# Altium schematic sheet DAC.SchDoc: Phaser
size 420 x 297 mm; EDA_Number: ARTIQ; Projet: ARTIQ/SINARA; Author: G.Kasprowicz; CompanyName: WUT ISE; DrawnBy: G.Kasprowicz; Organization: WUT ISE; Address1: PW ISE; Address2: Nowowiejska 15/19 00-665 Warsaw; Address3: gkasprow@gmail.com; Revision: 2; SheetNumber: -; SheetTotal: -; ModifiedBy: -; CheckedDate: -; Title2: xxx; DivGrp: WUT ISE; Designer: G.Kasprowicz; ModifiedDate: -; ProjectName: Sensor Box
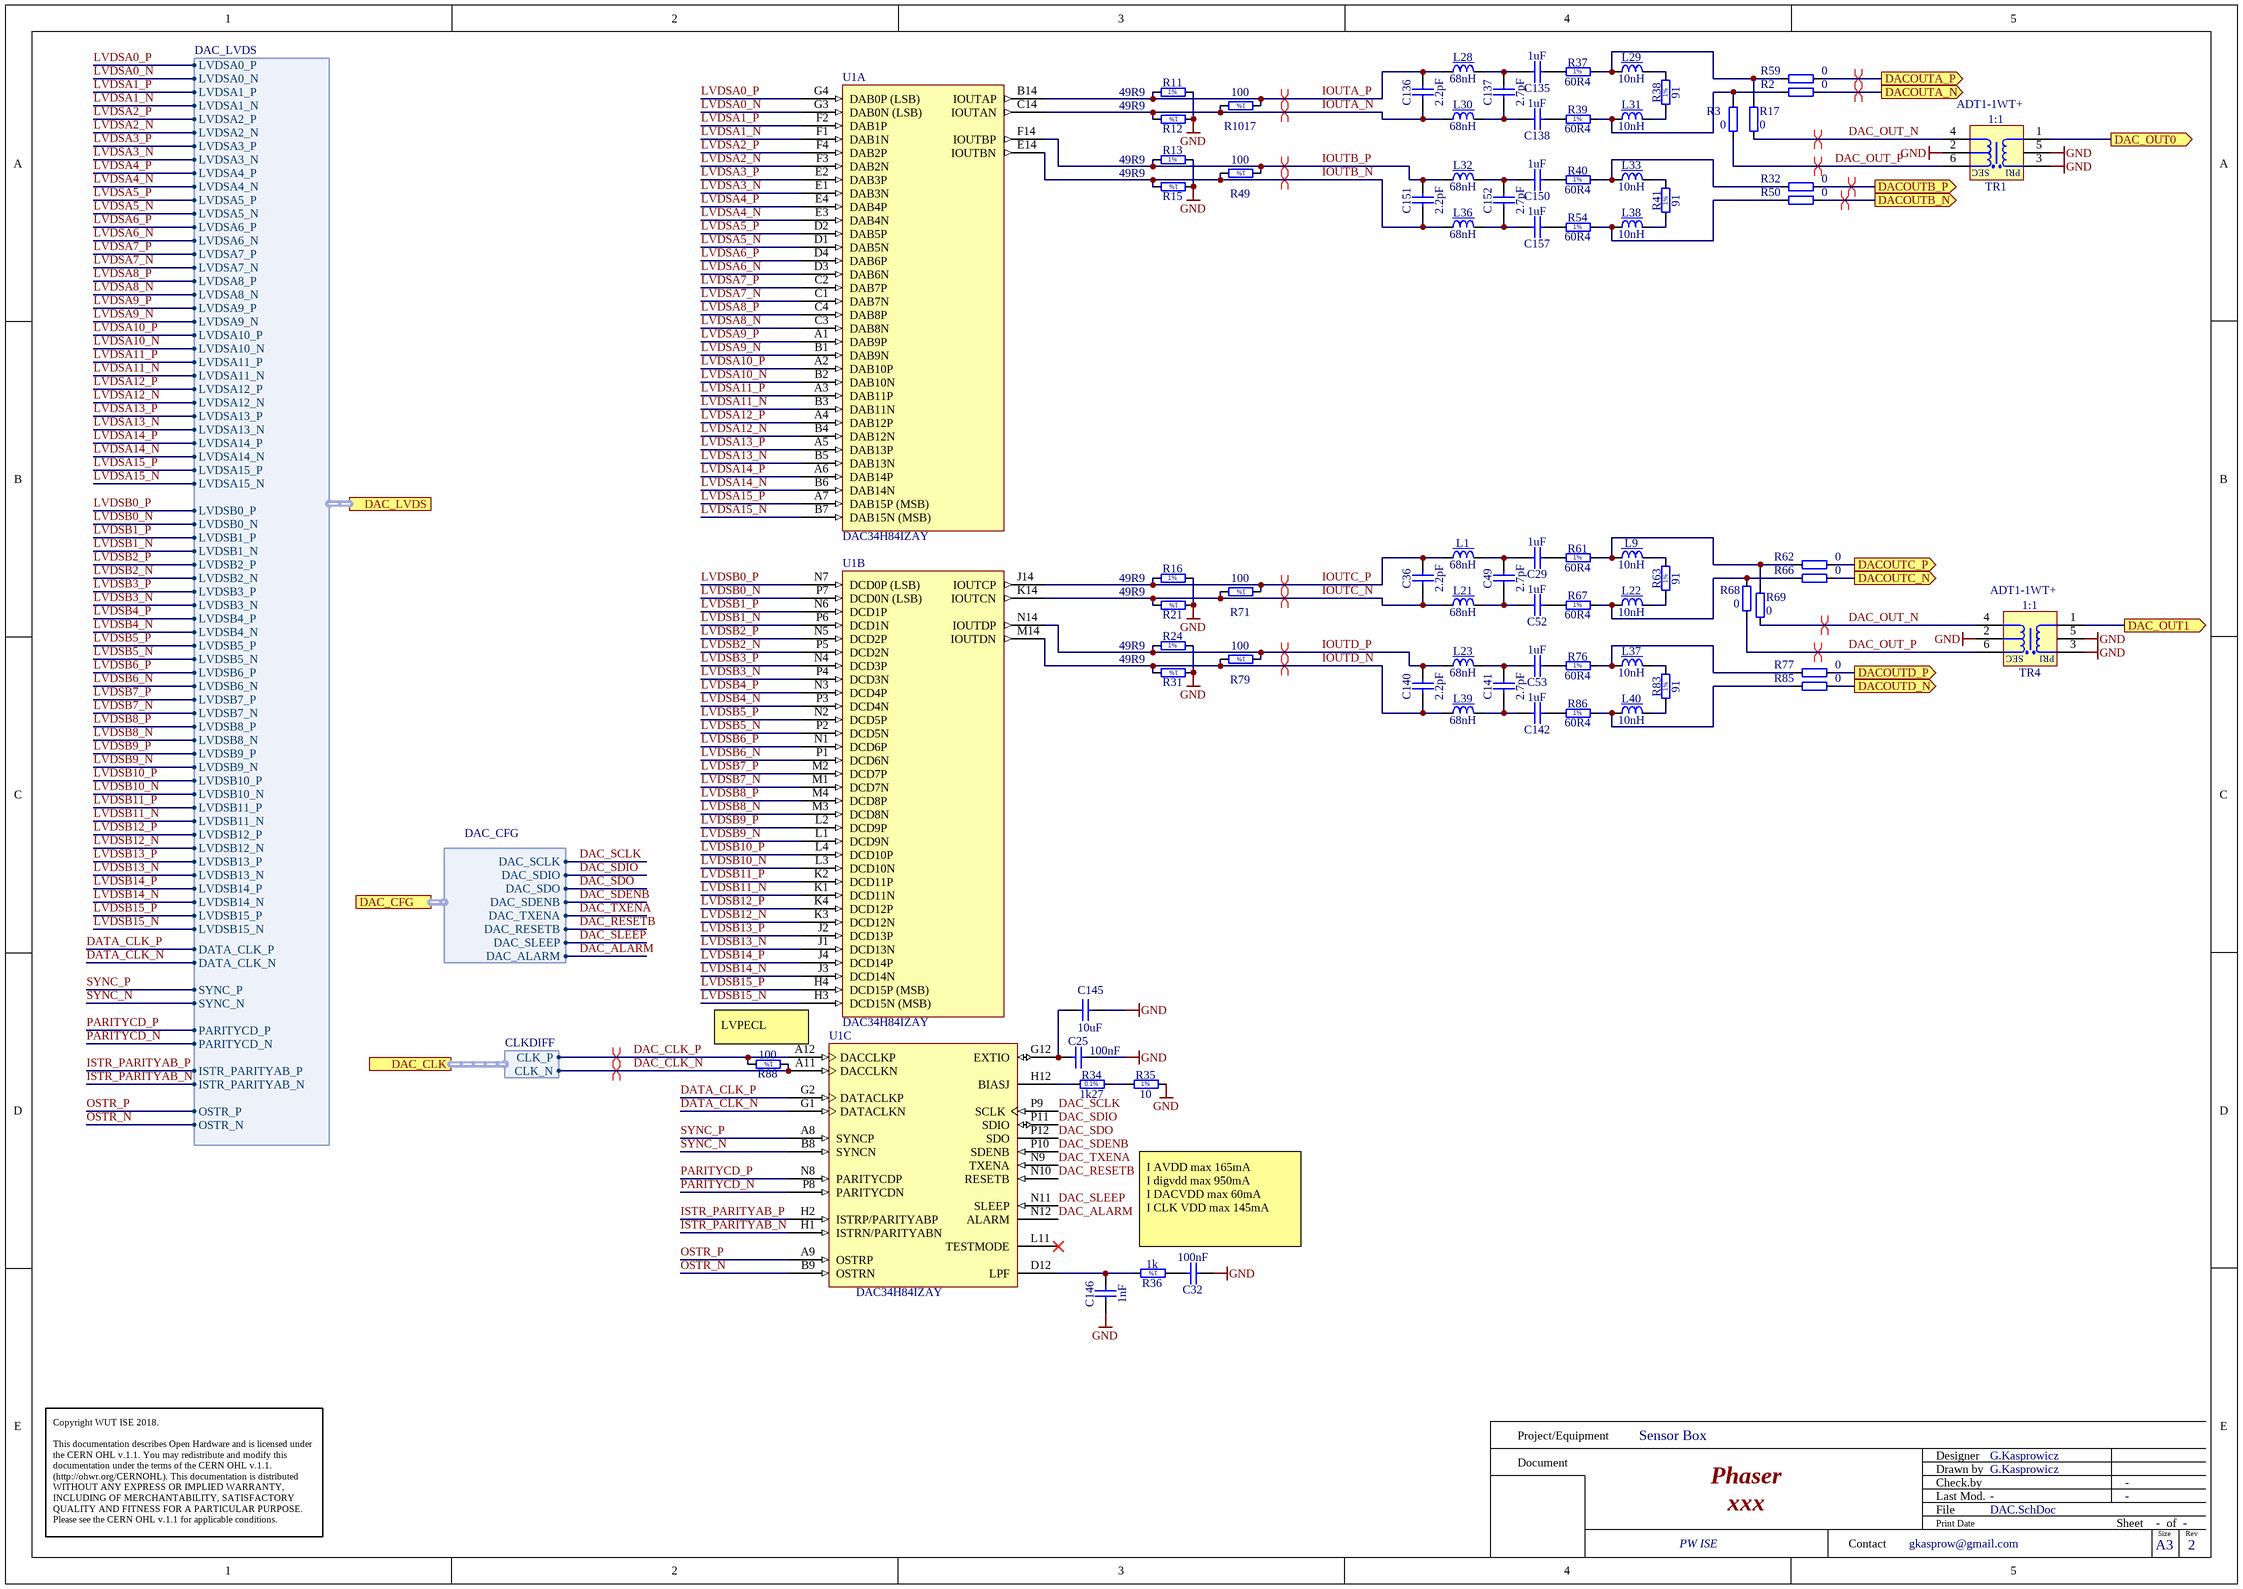
[diagram p0: DAC.SchDoc]

## Parts
C25  100nF  [CAPC1005X55N]
C29  1uF  [CAPC1005X55N]
C32  100nF  [CAPC1608X90N]
C36  2.2pF  [CAPC1608X87N]
C49  2.7pF  [CAPC1608X87N]
C52  1uF  [CAPC1005X55N]
C53  1uF  [CAPC1005X55N]
C135  1uF  [CAPC1005X55N]
C136  2.2pF  [CAPC1608X87N]
C137  2.7pF  [CAPC1608X87N]
C138  1uF  [CAPC1005X55N]
C140  2.2pF  [CAPC1608X87N]
C141  2.7pF  [CAPC1608X87N]
C142  1uF  [CAPC1005X55N]
C145  10uF  [CAPC2012X95N]
C146  1nF  [CAPC1608X90N]
C150  1uF  [CAPC1005X55N]
C151  2.2pF  [CAPC1608X87N]
C152  2.7pF  [CAPC1608X87N]
C157  1uF  [CAPC1005X55N]
L1  68nH  [IND_COILCRAFT_0603HP]
L9  10nH  [IND_COILCRAFT_0402DC]
L21  68nH  [IND_COILCRAFT_0603HP]
L22  10nH  [IND_COILCRAFT_0402DC]
L23  68nH  [IND_COILCRAFT_0603HP]
L28  68nH  [IND_COILCRAFT_0603HP]
L29  10nH  [IND_COILCRAFT_0402DC]
L30  68nH  [IND_COILCRAFT_0603HP]
L31  10nH  [IND_COILCRAFT_0402DC]
L32  68nH  [IND_COILCRAFT_0603HP]
L33  10nH  [IND_COILCRAFT_0402DC]
L36  68nH  [IND_COILCRAFT_0603HP]
L37  10nH  [IND_COILCRAFT_0402DC]
L38  10nH  [IND_COILCRAFT_0402DC]
L39  68nH  [IND_COILCRAFT_0603HP]
L40  10nH  [IND_COILCRAFT_0402DC]
R2  0  [RESC1005X40N]
R3  0  [RESC1005X40N]
R11  49R9  [RESC1005X40N]
R12  49R9  [RESC1005X40N]
R13  49R9  [RESC1005X40N]
R15  49R9  [RESC1005X40N]
R16  49R9  [RESC1005X40N]
R17  0  [RESC1005X40N]
R21  49R9  [RESC1005X40N]
R24  49R9  [RESC1005X40N]
R31  49R9  [RESC1005X40N]
R32  0  [RESC1005X40N]
R34  1k27  [RESC1608X55N]
R35  10  [RESC1005X40N]
R36  1k  [RESC1608X55N]
R37  60R4  [RESC1005X40N]
R38  91  [RESC1005X40N]
R39  60R4  [RESC1005X40N]
R40  60R4  [RESC1005X40N]
R41  91  [RESC1005X40N]
R49  100  [RESC0603X28N]
R50  0  [RESC1005X40N]
R54  60R4  [RESC1005X40N]
R59  0  [RESC1005X40N]
R61  60R4  [RESC1005X40N]
R62  0  [RESC1005X40N]
R63  91  [RESC1005X40N]
R66  0  [RESC1005X40N]
R67  60R4  [RESC1005X40N]
R68  0  [RESC1005X40N]
R69  0  [RESC1005X40N]
R71  100  [RESC0603X28N]
R76  60R4  [RESC1005X40N]
R77  0  [RESC1005X40N]
R79  100  [RESC0603X28N]
R83  91  [RESC1005X40N]
R85  0  [RESC1005X40N]
R86  60R4  [RESC1005X40N]
R88  100  [RESC0603X28N]
R1017  100  [RESC0603X28N]
TR1  1:1  Manufacturer Part Number: ADT1-1WT+  [XFMR_MINI-CIRCUITS_CD542]
TR4  1:1  Manufacturer Part Number: ADT1-1WT+  [XFMR_MINI-CIRCUITS_CD542]
U1  DAC34H84IZAY  [TI-ZAY196]  (parts A,B,C of 5)

## Ports
DAC_CFG (harness DAC_CFG), DAC_CLK (harness CLKDIFF), DAC_LVDS (harness DAC_LVDS), DAC_OUT0 (out), DAC_OUT1 (out), DACOUTA_N (out), DACOUTA_P (out), DACOUTB_N (out), DACOUTB_P (out), DACOUTC_N (out), DACOUTC_P (out), DACOUTD_N (out), DACOUTD_P (out)

## Harnesses
DAC_CFG: DAC_SCLK, DAC_SDIO, DAC_SDO, DAC_SDENB, DAC_TXENA, DAC_RESETB, DAC_SLEEP, DAC_ALARM
DAC_LVDS: LVDSA0_P, LVDSA0_N, LVDSA1_P, LVDSA1_N, LVDSA2_P, LVDSA2_N, LVDSA3_P, LVDSA3_N, LVDSA4_P, LVDSA4_N, LVDSA5_P, LVDSA5_N, LVDSA6_P, LVDSA6_N, LVDSA7_P, LVDSA7_N, LVDSA8_P, LVDSA8_N, LVDSA9_P, LVDSA9_N, LVDSA10_P, LVDSA10_N, LVDSA11_P, LVDSA11_N, LVDSA12_P, LVDSA12_N, LVDSA13_P, LVDSA13_N, LVDSA14_P, LVDSA14_N, LVDSA15_P, LVDSA15_N, LVDSB0_P, LVDSB0_N, LVDSB1_P, LVDSB1_N, LVDSB2_P, LVDSB2_N, LVDSB3_P, LVDSB3_N, LVDSB4_P, LVDSB4_N, LVDSB5_P, LVDSB5_N, LVDSB6_P, LVDSB6_N, LVDSB7_P, LVDSB7_N, LVDSB8_P, LVDSB8_N, LVDSB9_P, LVDSB9_N, LVDSB10_P, LVDSB10_N, LVDSB11_P, LVDSB11_N, LVDSB12_P, LVDSB12_N, LVDSB13_P, LVDSB13_N, LVDSB14_P, LVDSB14_N, LVDSB15_P, LVDSB15_N, DATA_CLK_P, DATA_CLK_N, SYNC_P, SYNC_N, PARITYCD_P, PARITYCD_N, ISTR_PARITYAB_P, ISTR_PARITYAB_N, OSTR_P, OSTR_N
CLKDIFF: CLK_N, CLK_P

## Nets
GND: C25.2 C32.1 C145.1 C146.1 R11.2 R12.1 R13.2 R15.1 R16.2 R21.1 R24.2 R31.1 R35.2 TR1.2(SCT) TR1.3(PDOT) TR1.5(NC) TR4.2(SCT) TR4.3(PDOT) TR4.5(NC)
DAC_ALARM: U1.N12(ALARM) ; port DAC_CFG.DAC_ALARM
DAC_CLK_N: R88.1 U1.A11(DACCLKN) ; port DAC_CLK.CLK_N
DAC_CLK_P: R88.2 U1.A12(DACCLKP) ; port DAC_CLK.CLK_P
DAC_OUT0: TR1.1(P) ; port DAC_OUT0
DAC_OUT1: TR4.1(P) ; port DAC_OUT1
DAC_OUT_N: R17.1 R69.1 TR1.4(S) TR4.4(S)
DAC_OUT_P: R3.1 R68.1 TR1.6(SDOT) TR4.6(SDOT)
DAC_RESETB: U1.N10(RESETB) ; port DAC_CFG.DAC_RESETB
DAC_SCLK: U1.P9(SCLK) ; port DAC_CFG.DAC_SCLK
DAC_SDENB: U1.P10(SDENB) ; port DAC_CFG.DAC_SDENB
DAC_SDIO: U1.P11(SDIO) ; port DAC_CFG.DAC_SDIO
DAC_SDO: U1.P12(SDO) ; port DAC_CFG.DAC_SDO
DAC_SLEEP: U1.N11(SLEEP) ; port DAC_CFG.DAC_SLEEP
DAC_TXENA: U1.N9(TXENA) ; port DAC_CFG.DAC_TXENA
DACOUTA_N: R2.1 ; port DACOUTA_N
DACOUTA_P: R59.1 ; port DACOUTA_P
DACOUTB_N: R50.1 ; port DACOUTB_N
DACOUTB_P: R32.1 ; port DACOUTB_P
DACOUTC_N: R66.1 ; port DACOUTC_N
DACOUTC_P: R62.1 ; port DACOUTC_P
DACOUTD_N: R85.1 ; port DACOUTD_N
DACOUTD_P: R77.1 ; port DACOUTD_P
DATA_CLK_N: U1.G1(DATACLKN) ; port DAC_LVDS.DATA_CLK_N
DATA_CLK_P: U1.G2(DATACLKP) ; port DAC_LVDS.DATA_CLK_P
IOUTA_N: C136.1 L30.1 R12.2 R1017.2 U1.C14(IOUTAN)
IOUTA_P: C136.2 L28.1 R11.1 R1017.1 U1.B14(IOUTAP)
IOUTB_N: C151.1 L36.1 R15.2 R49.2 U1.E14(IOUTBN)
IOUTB_P: C151.2 L32.1 R13.1 R49.1 U1.F14(IOUTBP)
IOUTC_N: C36.1 L21.1 R21.2 R71.2 U1.K14(IOUTCN)
IOUTC_P: C36.2 L1.1 R16.1 R71.1 U1.J14(IOUTCP)
IOUTD_N: C140.1 L39.1 R31.2 R79.2 U1.M14(IOUTDN)
IOUTD_P: C140.2 L23.1 R24.1 R79.1 U1.N14(IOUTDP)
ISTR_PARITYAB_N: U1.H1(ISTRN/PARITYABN) ; port DAC_LVDS.ISTR_PARITYAB_N
ISTR_PARITYAB_P: U1.H2(ISTRP/PARITYABP) ; port DAC_LVDS.ISTR_PARITYAB_P
LVDSA0_N: U1.G3(DAB0N_(LSB)) ; port DAC_LVDS.LVDSA0_N
LVDSA0_P: U1.G4(DAB0P_(LSB)) ; port DAC_LVDS.LVDSA0_P
LVDSA1_N: U1.F1(DAB1N) ; port DAC_LVDS.LVDSA1_N
LVDSA1_P: U1.F2(DAB1P) ; port DAC_LVDS.LVDSA1_P
LVDSA2_N: U1.F3(DAB2N) ; port DAC_LVDS.LVDSA2_N
LVDSA2_P: U1.F4(DAB2P) ; port DAC_LVDS.LVDSA2_P
LVDSA3_N: U1.E1(DAB3N) ; port DAC_LVDS.LVDSA3_N
LVDSA3_P: U1.E2(DAB3P) ; port DAC_LVDS.LVDSA3_P
LVDSA4_N: U1.E3(DAB4N) ; port DAC_LVDS.LVDSA4_N
LVDSA4_P: U1.E4(DAB4P) ; port DAC_LVDS.LVDSA4_P
LVDSA5_N: U1.D1(DAB5N) ; port DAC_LVDS.LVDSA5_N
LVDSA5_P: U1.D2(DAB5P) ; port DAC_LVDS.LVDSA5_P
LVDSA6_N: U1.D3(DAB6N) ; port DAC_LVDS.LVDSA6_N
LVDSA6_P: U1.D4(DAB6P) ; port DAC_LVDS.LVDSA6_P
LVDSA7_N: U1.C1(DAB7N) ; port DAC_LVDS.LVDSA7_N
LVDSA7_P: U1.C2(DAB7P) ; port DAC_LVDS.LVDSA7_P
LVDSA8_N: U1.C3(DAB8N) ; port DAC_LVDS.LVDSA8_N
LVDSA8_P: U1.C4(DAB8P) ; port DAC_LVDS.LVDSA8_P
LVDSA9_N: U1.B1(DAB9N) ; port DAC_LVDS.LVDSA9_N
LVDSA9_P: U1.A1(DAB9P) ; port DAC_LVDS.LVDSA9_P
LVDSA10_N: U1.B2(DAB10N) ; port DAC_LVDS.LVDSA10_N
LVDSA10_P: U1.A2(DAB10P) ; port DAC_LVDS.LVDSA10_P
LVDSA11_N: U1.B3(DAB11N) ; port DAC_LVDS.LVDSA11_N
LVDSA11_P: U1.A3(DAB11P) ; port DAC_LVDS.LVDSA11_P
LVDSA12_N: U1.B4(DAB12N) ; port DAC_LVDS.LVDSA12_N
LVDSA12_P: U1.A4(DAB12P) ; port DAC_LVDS.LVDSA12_P
LVDSA13_N: U1.B5(DAB13N) ; port DAC_LVDS.LVDSA13_N
LVDSA13_P: U1.A5(DAB13P) ; port DAC_LVDS.LVDSA13_P
LVDSA14_N: U1.B6(DAB14N) ; port DAC_LVDS.LVDSA14_N
LVDSA14_P: U1.A6(DAB14P) ; port DAC_LVDS.LVDSA14_P
LVDSA15_N: U1.B7(DAB15N_(MSB)) ; port DAC_LVDS.LVDSA15_N
LVDSA15_P: U1.A7(DAB15P_(MSB)) ; port DAC_LVDS.LVDSA15_P
LVDSB0_N: U1.P7(DCD0N_(LSB)) ; port DAC_LVDS.LVDSB0_N
LVDSB0_P: U1.N7(DCD0P_(LSB)) ; port DAC_LVDS.LVDSB0_P
LVDSB1_N: U1.P6(DCD1N) ; port DAC_LVDS.LVDSB1_N
LVDSB1_P: U1.N6(DCD1P) ; port DAC_LVDS.LVDSB1_P
LVDSB2_N: U1.P5(DCD2N) ; port DAC_LVDS.LVDSB2_N
LVDSB2_P: U1.N5(DCD2P) ; port DAC_LVDS.LVDSB2_P
LVDSB3_N: U1.P4(DCD3N) ; port DAC_LVDS.LVDSB3_N
LVDSB3_P: U1.N4(DCD3P) ; port DAC_LVDS.LVDSB3_P
LVDSB4_N: U1.P3(DCD4N) ; port DAC_LVDS.LVDSB4_N
LVDSB4_P: U1.N3(DCD4P) ; port DAC_LVDS.LVDSB4_P
LVDSB5_N: U1.P2(DCD5N) ; port DAC_LVDS.LVDSB5_N
LVDSB5_P: U1.N2(DCD5P) ; port DAC_LVDS.LVDSB5_P
LVDSB6_N: U1.P1(DCD6N) ; port DAC_LVDS.LVDSB6_N
LVDSB6_P: U1.N1(DCD6P) ; port DAC_LVDS.LVDSB6_P
LVDSB7_N: U1.M1(DCD7N) ; port DAC_LVDS.LVDSB7_N
LVDSB7_P: U1.M2(DCD7P) ; port DAC_LVDS.LVDSB7_P
LVDSB8_N: U1.M3(DCD8N) ; port DAC_LVDS.LVDSB8_N
LVDSB8_P: U1.M4(DCD8P) ; port DAC_LVDS.LVDSB8_P
LVDSB9_N: U1.L1(DCD9N) ; port DAC_LVDS.LVDSB9_N
LVDSB9_P: U1.L2(DCD9P) ; port DAC_LVDS.LVDSB9_P
LVDSB10_N: U1.L3(DCD10N) ; port DAC_LVDS.LVDSB10_N
LVDSB10_P: U1.L4(DCD10P) ; port DAC_LVDS.LVDSB10_P
LVDSB11_N: U1.K1(DCD11N) ; port DAC_LVDS.LVDSB11_N
LVDSB11_P: U1.K2(DCD11P) ; port DAC_LVDS.LVDSB11_P
LVDSB12_N: U1.K3(DCD12N) ; port DAC_LVDS.LVDSB12_N
LVDSB12_P: U1.K4(DCD12P) ; port DAC_LVDS.LVDSB12_P
LVDSB13_N: U1.J1(DCD13N) ; port DAC_LVDS.LVDSB13_N
LVDSB13_P: U1.J2(DCD13P) ; port DAC_LVDS.LVDSB13_P
LVDSB14_N: U1.J3(DCD14N) ; port DAC_LVDS.LVDSB14_N
LVDSB14_P: U1.J4(DCD14P) ; port DAC_LVDS.LVDSB14_P
LVDSB15_N: U1.H3(DCD15N_(MSB)) ; port DAC_LVDS.LVDSB15_N
LVDSB15_P: U1.H4(DCD15P_(MSB)) ; port DAC_LVDS.LVDSB15_P
OSTR_N: U1.B9(OSTRN) ; port DAC_LVDS.OSTR_N
OSTR_P: U1.A9(OSTRP) ; port DAC_LVDS.OSTR_P
PARITYCD_N: U1.P8(PARITYCDN) ; port DAC_LVDS.PARITYCD_N
PARITYCD_P: U1.N8(PARITYCDP) ; port DAC_LVDS.PARITYCD_P
SYNC_N: U1.B8(SYNCN) ; port DAC_LVDS.SYNC_N
SYNC_P: U1.A8(SYNCP) ; port DAC_LVDS.SYNC_P
NetC25_1: C25.1 C145.2 U1.G12(EXTIO)
NetC29_1: C29.1 R61.1
NetC29_2: C29.2 C49.2 L1.2
NetC32_2: C32.2 R36.1
NetC49_1: C49.1 C52.2 L21.2
NetC52_1: C52.1 R67.1
NetC53_1: C53.1 R76.1
NetC53_2: C53.2 C141.2 L23.2
NetC135_1: C135.1 R37.1
NetC135_2: C135.2 C137.2 L28.2
NetC137_1: C137.1 C138.2 L30.2
NetC138_1: C138.1 R39.1
NetC141_1: C141.1 C142.2 L39.2
NetC142_1: C142.1 R86.1
NetC146_2: C146.2 R36.2 U1.D12(LPF)
NetC150_1: C150.1 R40.1
NetC150_2: C150.2 C152.2 L32.2
NetC152_1: C152.1 C157.2 L36.2
NetC157_1: C157.1 R54.1
NetL9_1: L9.1 R61.2 R62.2 R69.2
NetL9_2: L9.2 R63.2
NetL22_1: L22.1 R66.2 R67.2 R68.2
NetL22_2: L22.2 R63.1
NetL29_1: L29.1 R17.2 R37.2 R59.2
NetL29_2: L29.2 R38.2
NetL31_1: L31.1 R2.2 R3.2 R39.2
NetL31_2: L31.2 R38.1
NetL33_1: L33.1 R32.2 R40.2
NetL33_2: L33.2 R41.2
NetL37_1: L37.1 R76.2 R77.2
NetL37_2: L37.2 R83.2
NetL38_1: L38.1 R50.2 R54.2
NetL38_2: L38.2 R41.1
NetL40_1: L40.1 R85.2 R86.2
NetL40_2: L40.2 R83.1
NetR34_1: R34.1 U1.H12(BIASJ)
NetR34_2: R34.2 R35.1

Not connected (* = marked no-connect by the designer): U1 L11(TESTMODE)*

## Layout directives
differential pair; differential pair class I_analog: IOUTA_N, IOUTA_P, IOUTB_N, IOUTB_P, IOUTC_N, IOUTC_P, IOUTD_N, IOUTD_P
differential pair; differential pair class Diff_100Ohm: DAC_CLK_N, DAC_CLK_P
differential pair: DAC_OUT_N, DAC_OUT_P, DACOUTA_N, DACOUTA_P, DACOUTB_N, DACOUTB_P

## Notes on the sheet
- LVPECL
- I AVDD max 165mA
  I digvdd max 950mA
  I DACVDD max 60mA
  I CLK VDD max 145mA
- Project/Equipment
- Document
- Designer
- Drawn by
- Check.by
- Copyright WUT ISE 2018.
  This documentation describes Open Hardware and is licensed under the CERN OHL v.1.1. You may redistribute and modify this documentation under the terms of the CERN OHL v.1.1. (http://ohwr.org/CERNOHL). This documentation is distributed WITHOUT ANY EXPRESS OR IMPLIED WARRANTY, INCLUDING OF MERCHANTABILITY, SATISFACTORY QUALITY AND FITNESS FOR A PARTICULAR PURPOSE. Please see the CERN OHL v.1.1 for applicable conditions.
- Contact
- File
- Last Mod.
- Print Date
- Sheet
- Size
- A3
- of
- Rev
- (in symbol R0201_100R_1%_0.05W_200PPM) 1%
- (in symbol R0402_10R_1%_0.0625W_200PPM) 1%
- (in symbol R0402_49R9_1%_0.0625W_100PPM) 1%
- (in symbol R0402_60R4_1%_0.0625W_100PPM) 1%
- (in symbol R0402_91R_1%_0.0625W_100PPM) 1%
- (in symbol R0603_1K27_0.1%_0.063W_10PPM) 0.1%
- (in symbol R0603_1K_1%_0.1W_100PPM) 1%
- (in symbol XFMR_MINI-CIRCUITS_ADT1-1WT+) SEC; PRI

## Library data of the parts
C25 = CC0402_100NF_16V_10%_X5R: Non-polarised capacitor; Part Description: SMD Multilayer Chip Ceramic Capacitor; Manufacturer: GENERIC; Manufacturer1 Part Number: GRM155R61C104KA88D; Voltage: 16V; TC: X5R; Tolerance: ±10%; Part Number: CC0402_100NF_16V_10%_X5R; Component Kind: Standard; Component Type: Standard; Pin Count: 2; Value: 100nF; Status: None; Manufacturer Part Number: CC0402_100NF_16V_10%_X5R; Case: 0402; Mounted: Yes; Socket: No; SMD: Yes; Sense: No; Manufacturer1 Example: MURATA; Manufacturer1 ComponentHeight: 0.55mm; HelpURL: \\cern.ch\dfs\Applications\Altium\Datasheets\CC0402_X5R_MURATA_GRM.pdf; Author: CERN DEM JLC; CreateDate: 10.12.2013; LatestRevisionDate: 10.12.2013
C29 C52 C53 C135 C138 C142 C150 C157 = CC0402_1UF_16V_10%_X5R: Non-polarised capacitor; Part Description: SMD Multilayer Chip Ceramic Capacitor; Manufacturer: GENERIC; Manufacturer1 Part Number: C1005X5R1C105KT; Voltage: 16V; TC: X5R; Tolerance: ±10%; Part Number: CC0402_1UF_16V_10%_X5R; Component Kind: Standard; Component Type: Standard; Pin Count: 2; Value: 1uF; Status: Preferred; Manufacturer Part Number: CC0402_1UF_16V_10%_X5R; Case: 0402; Mounted: Yes; Socket: No; SMD: Yes; Sense: No; Manufacturer1 Example: TDK; Manufacturer1 ComponentHeight: 0.55mm; HelpURL: \\cern.ch\dfs\Applications\Altium\Datasheets\CC0402_X5R_TDK_C.pdf; Author: CERN DEM JLC; CreateDate: 25.10.2012; LatestRevisionDate: 25.10.2012
C32 = CC0603_100NF_100V_10%_X7R: Non-polarised capacitor; Part Description: SMD Multilayer Chip Ceramic Capacitor; Manufacturer: GENERIC; Manufacturer1 Part Number: GRM188R72A104KA35D; Voltage: 100V; TC: X7R; Tolerance: ±10%; Part Number: CC0603_100NF_100V_10%_X7R; Component Kind: Standard; Component Type: Standard; Pin Count: 2; Value: 100nF; Status: None; Manufacturer Part Number: CC0603_100NF_100V_10%_X7R; Case: 0603; Mounted: Yes; Socket: No; SMD: Yes; Sense: No; Manufacturer1 Example: MURATA; Manufacturer1 ComponentHeight: 0.9mm; HelpURL: \\cern.ch\dfs\Applications\Altium\Datasheets\CC0603_MURATA_GRM188R72A104KA35D.pdf; Author: CERN DEM JLC; CreateDate: 11.12.2013; LatestRevisionDate: 11.12.2013
C36 C136 C140 C151 = CC0603_2.2PF_50V_0.25PF_NP0: Non-polarised capacitor; Part Description: SMD Multilayer Chip Ceramic Capacitor; Manufacturer: GENERIC; Manufacturer1 Part Number: 223886715228; Voltage: 50V; TC: C0G/NP0; Tolerance: ±0.25pF; Part Number: CC0603_2.2PF_50V_0.25PF_NP0; Component Kind: Standard; Component Type: Standard; Pin Count: 2; Value: 2.2pF; Status: Preferred; Manufacturer Part Number: CC0603_2.2PF_50V_0.25PF_NP0; Case: 0603; Mounted: Yes; Socket: No; SMD: Yes; Sense: No; Manufacturer1 Example: PHYCOMP; Manufacturer1 ComponentHeight: 0.87mm; HelpURL: \\cern.ch\dfs\Applications\Altium\Datasheets\CC0603_NP0_PHYCOMP.pdf; Author: CERN DEM JLC; CreateDate: 03.12.2007; LatestRevisionDate: 03.12.2007
C49 C137 C141 C152 = CC0603_2.7PF_50V_0.25PF_NP0: Non-polarised capacitor; Part Description: SMD Multilayer Chip Ceramic Capacitor; Manufacturer: GENERIC; Manufacturer1 Part Number: 223886715278; Voltage: 50V; TC: C0G/NP0; Tolerance: ±0.25pF; Part Number: CC0603_2.7PF_50V_0.25PF_NP0; Component Kind: Standard; Component Type: Standard; Pin Count: 2; Value: 2.7pF; Status: Preferred; Manufacturer Part Number: CC0603_2.7PF_50V_0.25PF_NP0; Case: 0603; Mounted: Yes; Socket: No; SMD: Yes; Sense: No; Manufacturer1 Example: PHYCOMP; Manufacturer1 ComponentHeight: 0.87mm; HelpURL: \\cern.ch\dfs\Applications\Altium\Datasheets\CC0603_NP0_PHYCOMP.pdf; Author: CERN DEM JLC; CreateDate: 03.12.2007; LatestRevisionDate: 03.12.2007
C145 = CC0805_10UF_25V_10%_X5R: Non-polarised capacitor; Part Description: SMD Multilayer Chip Ceramic Capacitor; Manufacturer: GENERIC; Manufacturer1 Part Number: GRM219R61E106KA12D; Voltage: 25V; TC: X5R; Tolerance: ±10%; Part Number: CC0805_10UF_25V_10%_X5R; Component Kind: Standard; Component Type: Standard; Pin Count: 2; Value: 10uF; Status: Preferred; Manufacturer Part Number: CC0805_10UF_25V_10%_X5R; Case: 0805; Mounted: Yes; Socket: No; SMD: Yes; Sense: No; Manufacturer1 Example: MURATA; Manufacturer1 ComponentHeight: 0.95mm; HelpURL: \\cern.ch\dfs\Applications\Altium\Datasheets\CC0805_X5R_MURATA_GRM.pdf; Author: CERN DEM JLC; CreateDate: 25.10.2012; LatestRevisionDate: 06.09.2016
C146 = CC0603_1NF_50V_1%_NP0: Non-polarised capacitor; Part Description: SMD Multilayer Chip Ceramic Capacitor; Manufacturer: GENERIC; Manufacturer1 Part Number: 06035A102FAT2A; Voltage: 50V; TC: C0G/NP0; Tolerance: ±1%; Part Number: CC0603_1NF_50V_1%_NP0; Component Kind: Standard; Component Type: Standard; Pin Count: 2; Value: 1nF; Status: None; Manufacturer Part Number: CC0603_1NF_50V_1%_NP0; Case: 0603; Mounted: Yes; Socket: No; SMD: Yes; Sense: No; Manufacturer1 Example: AVX; Manufacturer1 ComponentHeight: 0.9mm; HelpURL: \\cern.ch\dfs\Applications\Altium\Datasheets\CC0603_C0G_AVX.pdf; Author: CERN DEM JLC; CreateDate: 15.06.2017; LatestRevisionDate: 15.06.2017
L1 L21 L23 L28 L30 L32 L36 L39 = IND0603_68NH_2%_COILCRAFT_0603HP-68NXGLU: Inductor With Core; Part Description: Ceramic Chip Inductor; Power: 600mA; Resistance: 0.33R; Tolerance: ±2%; Part Number: IND0603_68NH_2%_COILCRAFT_0603HP-68NXGLU; Component Kind: Standard; Component Type: Standard; Pin Count: 2; Value: 68nH; Status: None; Manufacturer: COILCRAFT; Manufacturer Part Number: 0603HP-68NXGLU; Case: 0603; Mounted: Yes; Socket: No; SMD: Yes; Sense: No; ComponentHeight: 0.94mm; HelpURL: \\cern.ch\dfs\Applications\Altium\Datasheets\IND0603_COILCRAFT_0603HP.pdf; Author: CERN DEM JLC; CreateDate: 16.11.2017; LatestRevisionDate: 16.11.2017
L9 L22 L29 L31 L33 L37 L38 L40 = IND0402_10NH_2%_COILCRAFT_0402DC: Inductor With Core; Part Description: Ceramic Wirewound Chip Inductor, 0402DC Series; Manufacturer Part Number: 0402DC-10NXGRW; Power: 1A; Resistance: 0.073R; Tolerance: ±2%; Part Number: IND0402_10NH_2%_COILCRAFT_0402DC; Component Kind: Standard; Component Type: Standard; Pin Count: 2; Value: 10nH; Status: None; Manufacturer: COILCRAFT; Case: 0402; Mounted: Yes; Socket: No; SMD: Yes; Sense: No; ComponentHeight: 0.61mm; HelpURL: \\cern.ch\dfs\Applications\Altium\Datasheets\IND0402_COILCRAFT_0402DC.pdf; Author: GK; CreateDate: 04.12.2018; LatestRevisionDate: 04.12.2018
R2 R3 R17 R32 R50 R59 R62 R66 R68 R69 R77 R85 = R0402_0R_JUMPER: Resistor; Part Description: 1A (0.05R Max DC Resistance) Zero Ohm Jumper; Manufacturer: GENERIC; Manufacturer1 Part Number: 232270591001L; Part Number: R0402_0R_JUMPER; Component Kind: Standard; Component Type: Standard; Pin Count: 2; Value: 0; Status: Not recommended; Manufacturer Part Number: R0402_0R_JUMPER; Case: 0402; Mounted: Yes; Sense: No; Socket: No; SMD: Yes; Manufacturer1 Example: YAGEO PHYCOMP; Manufacturer1 ComponentHeight: 0.4mm; HelpURL: \\cern.ch\dfs\Applications\Altium\Datasheets\R0402_Phycomp_RC0402.pdf; Author: CERN DEM JLC; CreateDate: 2007-12-03; LatestRevisionDate: 2012-10-17
R11-R13 R15 R16 R21 R24 R31 = R0402_49R9_1%_0.0625W_100PPM: Resistor - 1%; Part Description: General Purpose Thick Film Chip Resistor; Manufacturer: GENERIC; Manufacturer1 Part Number: 232270674999L or RC0402FR-0749R9L; TC: ±100ppm/°C; PressFit: No; Part Number: R0402_49R9_1%_0.0625W_100PPM; Component Kind: Standard; Component Type: Standard; Pin Count: 2; Value: 49R9; Status: Not Recommended; Power: 0.0625W; Tolerance: ±1%; Manufacturer Part Number: R0402_49R9_1%_0.0625W_100PPM; Case: 0402; Mounted: Yes; Sense: No; Socket: No; SMD: Yes; Manufacturer1 Example: YAGEO PHYCOMP; Manufacturer1 ComponentHeight: 0.4mm; HelpURL: \\cern.ch\dfs\Applications\Altium\Datasheets\R0402_Phycomp_RC0402.pdf; Author: CERN DEM JLC; CreateDate: 24.10.2012; LatestRevisionDate: 24.10.2012
R34 = R0603_1K27_0.1%_0.063W_10PPM: Resistor - 0.1%; Part Description: Thin Film Chip Resistor; Manufacturer: GENERIC; Manufacturer1 Part Number: RN73C1J1K27BTDF; Power: 0.063W; TC: ±10ppm; PressFit: No; Part Number: R0603_1K27_0.1%_0.063W_10PPM; Component Kind: Standard; Component Type: Standard; Pin Count: 2; Value: 1k27; Status: Not Recommended; Tolerance: ±0.1%; Manufacturer Part Number: R0603_1K27_0.1%_0.063W_10PPM; Case: 0603; Mounted: Yes; Sense: No; Socket: No; SMD: Yes; Manufacturer1 Example: TYCO HOLSWORTHY; Manufacturer1 ComponentHeight: 0.5mm; HelpURL: \\cern.ch\dfs\Applications\Altium\Datasheets\R0603_Tyco_RN73.pdf; Author: CERN DEM JLC; CreateDate: 03.12.2007; LatestRevisionDate: 13.03.2008
R35 = R0402_10R_1%_0.0625W_200PPM: Resistor - 1%; Part Description: General Purpose Thick Film Chip Resistor; Manufacturer: GENERIC; Manufacturer1 Part Number: 232270671009L; TC: ±200ppm/°C; PressFit: No; Part Number: R0402_10R_1%_0.0625W_200PPM; Component Kind: Standard; Component Type: Standard; Pin Count: 2; Value: 10; Status: Not Recommended; Power: 0.0625W; Tolerance: ±1%; Manufacturer Part Number: R0402_10R_1%_0.0625W_200PPM; Case: 0402; Mounted: Yes; Sense: No; Socket: No; SMD: Yes; Manufacturer1 Example: YAGEO PHYCOMP; Manufacturer1 ComponentHeight: 0.4mm; HelpURL: \\cern.ch\dfs\Applications\Altium\Datasheets\R0402_Phycomp_RC0402.pdf; Author: CERN DEM JLC; CreateDate: 24.06.2009; LatestRevisionDate: 17.10.2012
R36 = R0603_1K_1%_0.1W_100PPM: Resistor - 1%; Part Description: General Purpose Thick Film Chip Resistor; Manufacturer: GENERIC; Manufacturer1 Part Number: NRC06F1001TRF; Power: 0.1W; TC: ±100ppm/°C; PressFit: No; Part Number: R0603_1K_1%_0.1W_100PPM; Component Kind: Standard; Component Type: Standard; Pin Count: 2; Value: 1k; Status: Preferred; Tolerance: ±1%; Manufacturer Part Number: R0603_1K_1%_0.1W_100PPM; Case: 0603; Mounted: Yes; Sense: No; Socket: No; SMD: Yes; Manufacturer1 Example: NIC COMPONENT; Manufacturer1 ComponentHeight: 0.55mm; HelpURL: \\cern.ch\dfs\Applications\Altium\Datasheets\R0603_NIC_NRC.pdf; Author: CERN DEM JLC; CreateDate: 03.12.2007; LatestRevisionDate: 13.03.2008
R37 R39 R40 R54 R61 R67 R76 R86 = R0402_60R4_1%_0.0625W_100PPM: Resistor - 1%; Part Description: General Purpose Thick Film Chip Resistor; Manufacturer: GENERIC; Manufacturer1 Part Number: RC0402FR-0760R4L; TC: ±100ppm/°C; PressFit: No; Part Number: R0402_60R4_1%_0.0625W_100PPM; Component Kind: Standard; Component Type: Standard; Pin Count: 2; Value: 60R4; Status: Recommended; Power: 0.0625W; Tolerance: ±1%; Manufacturer Part Number: R0402_60R4_1%_0.0625W_100PPM; Case: 0402; Mounted: Yes; Sense: No; Socket: No; SMD: Yes; Manufacturer1 Example: YAGEO; Manufacturer1 ComponentHeight: 0.4mm; HelpURL: \\cern.ch\dfs\Applications\Altium\Datasheets\R0402_Phycomp_RC0402.pdf; Author: GK; CreateDate: 03.12.2007; LatestRevisionDate: 17.10.2012
R38 R41 R63 R83 = R0402_91R_1%_0.0625W_100PPM: Resistor - 1%; Part Description: General Purpose Thick Film Chip Resistor; Manufacturer: GENERIC; Manufacturer1 Part Number: 232270679109L; TC: ±100ppm/°C; PressFit: No; Part Number: R0402_91R_1%_0.0625W_100PPM; Component Kind: Standard; Component Type: Standard; Pin Count: 2; Value: 91; Status: Not Recommended; Power: 0.0625W; Tolerance: ±1%; Manufacturer Part Number: R0402_91R_1%_0.0625W_100PPM; Case: 0402; Mounted: Yes; Sense: No; Socket: No; SMD: Yes; Manufacturer1 Example: YAGEO PHYCOMP; Manufacturer1 ComponentHeight: 0.4mm; HelpURL: \\cern.ch\dfs\Applications\Altium\Datasheets\R0402_Phycomp_RC0402.pdf; Author: CERN DEM JLC; CreateDate: 03.12.2007; LatestRevisionDate: 17.10.2012
R49 R71 R79 R88 R1017 = R0201_100R_1%_0.05W_200PPM: Resistor - 1%; Part Description: Thick Film Chip Resistor; Manufacturer: GENERIC; Manufacturer1 Part Number: CRCW0201100RFNED; Power: 0.05W; TC: ±200ppm/°C; PressFit: No; Part Number: R0201_100R_1%_0.05W_200PPM; Component Kind: Standard; Component Type: Standard; Pin Count: 2; Value: 100; Status: Not Recommended; Tolerance: ±1%; Manufacturer Part Number: R0201_100R_1%_0.05W_200PPM; Case: 0201; Mounted: Yes; Sense: No; Socket: No; SMD: Yes; Manufacturer1 Example: VISHAY; Manufacturer1 ComponentHeight: 0.27mm; HelpURL: \\cern.ch\dfs\Applications\Altium\Datasheets\R0201_VISHAY_CRCW0201 e3.pdf; Author: CERN DEM JLC; CreateDate: 13.11.2014; LatestRevisionDate: 13.11.2014
TR1 TR4 = XFMR_MINI-CIRCUITS_ADT1-1WT+: 75 Ohm 0.4 To 800MHz RF Transformers; Part Description: 75 Ohms 0.4 to 800 MHz RF Transformer; Part Number: XFMR_MINI-CIRCUITS_ADT1-1WT+; Component Kind: Standard; Component Type: Standard; Pin Count: 6; Value: 1:1; Status: None; Manufacturer: MINI-CIRCUITS; Mounted: Yes; Socket: No; Sense: No; SMD: Yes; ComponentHeight: 2.84mm; HelpURL: \\cern.ch\dfs\Applications\Altium\Datasheets\XFMR_MINI-CIRCUITS_ADT1-1WT+.pdf; Author: CERN DEM JLC; CreateDate: 21.09.2011; LatestRevisionDate: 21.09.2011
U1 = CMP-0004-01532-1: Quad-Channel, 16-Bit, 1.5 GSPS DAC, -40 to 85 degC, 196-pin BGA (ZAY196), Green (RoHS & no Sb/Br); Manufacturer: Texas Instruments; Interface: Parallel LVDS; Resolution(Bits): 16; SubFamily: High Speed DAC (>10MSPS); Power Consumption(Typ)(mW): 1828; SFDR(dB): 78; DAC Channels: 4; Mounting Technology: Surface Mount; ComponentLink3URL: http://www.ti.com/litv/pdf/mpbga11; PartNumber: DAC34H84IZAY; ComponentLink1Description: Manufacturer URL; Eco-Plan: Green (RoHS & no Sb/Br); PackageDescription: 196-Pin Plastic Ball Grid Array, Body 12 x 12 mm, Pitch 0.8 mm; PackageVersion: 4208324-4/C, 09/2010; PackageReference: ZAY196; ComponentLink1URL: http://www.ti.com/; ComponentLink2URL: http://www.ti.com/general/docs/lit/getliterature.tsp?genericPartNumber=DAC34SH84&fileType=pdf; DatasheetVersion: SLAS808D; ComponentLink3Description: Package Specification; ComponentLink2Description: Datasheet